# Altium project 电眼主板.PrjPCB
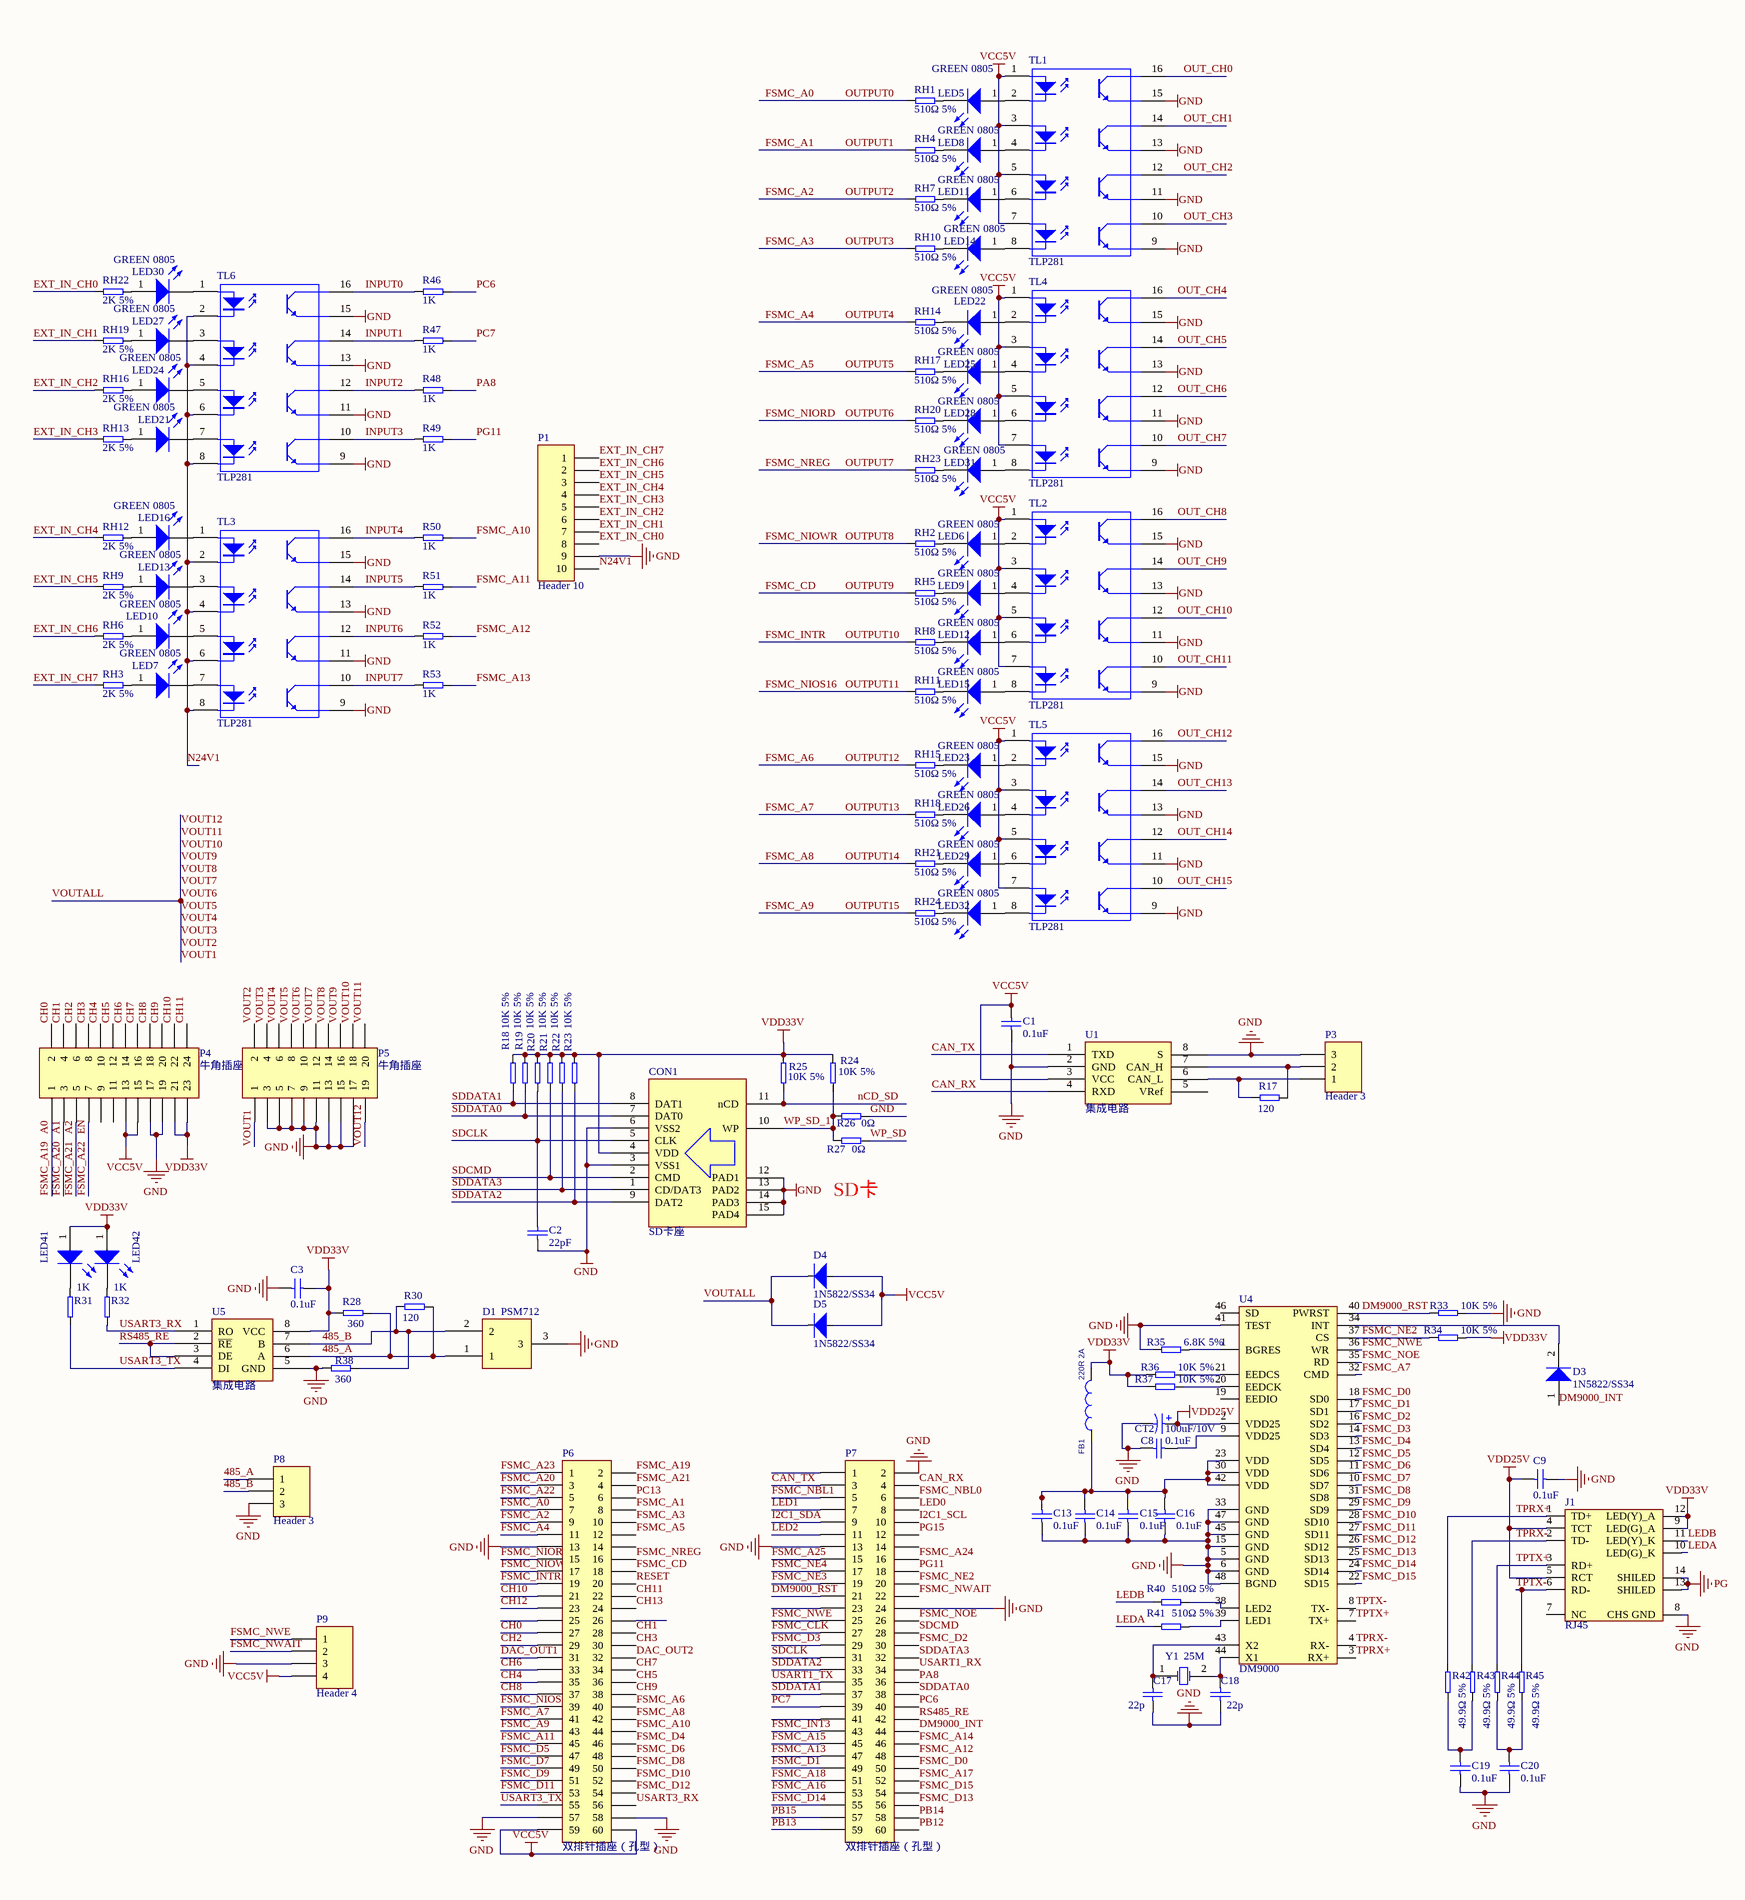
[diagram p0: 电眼主板.SchDoc, left]
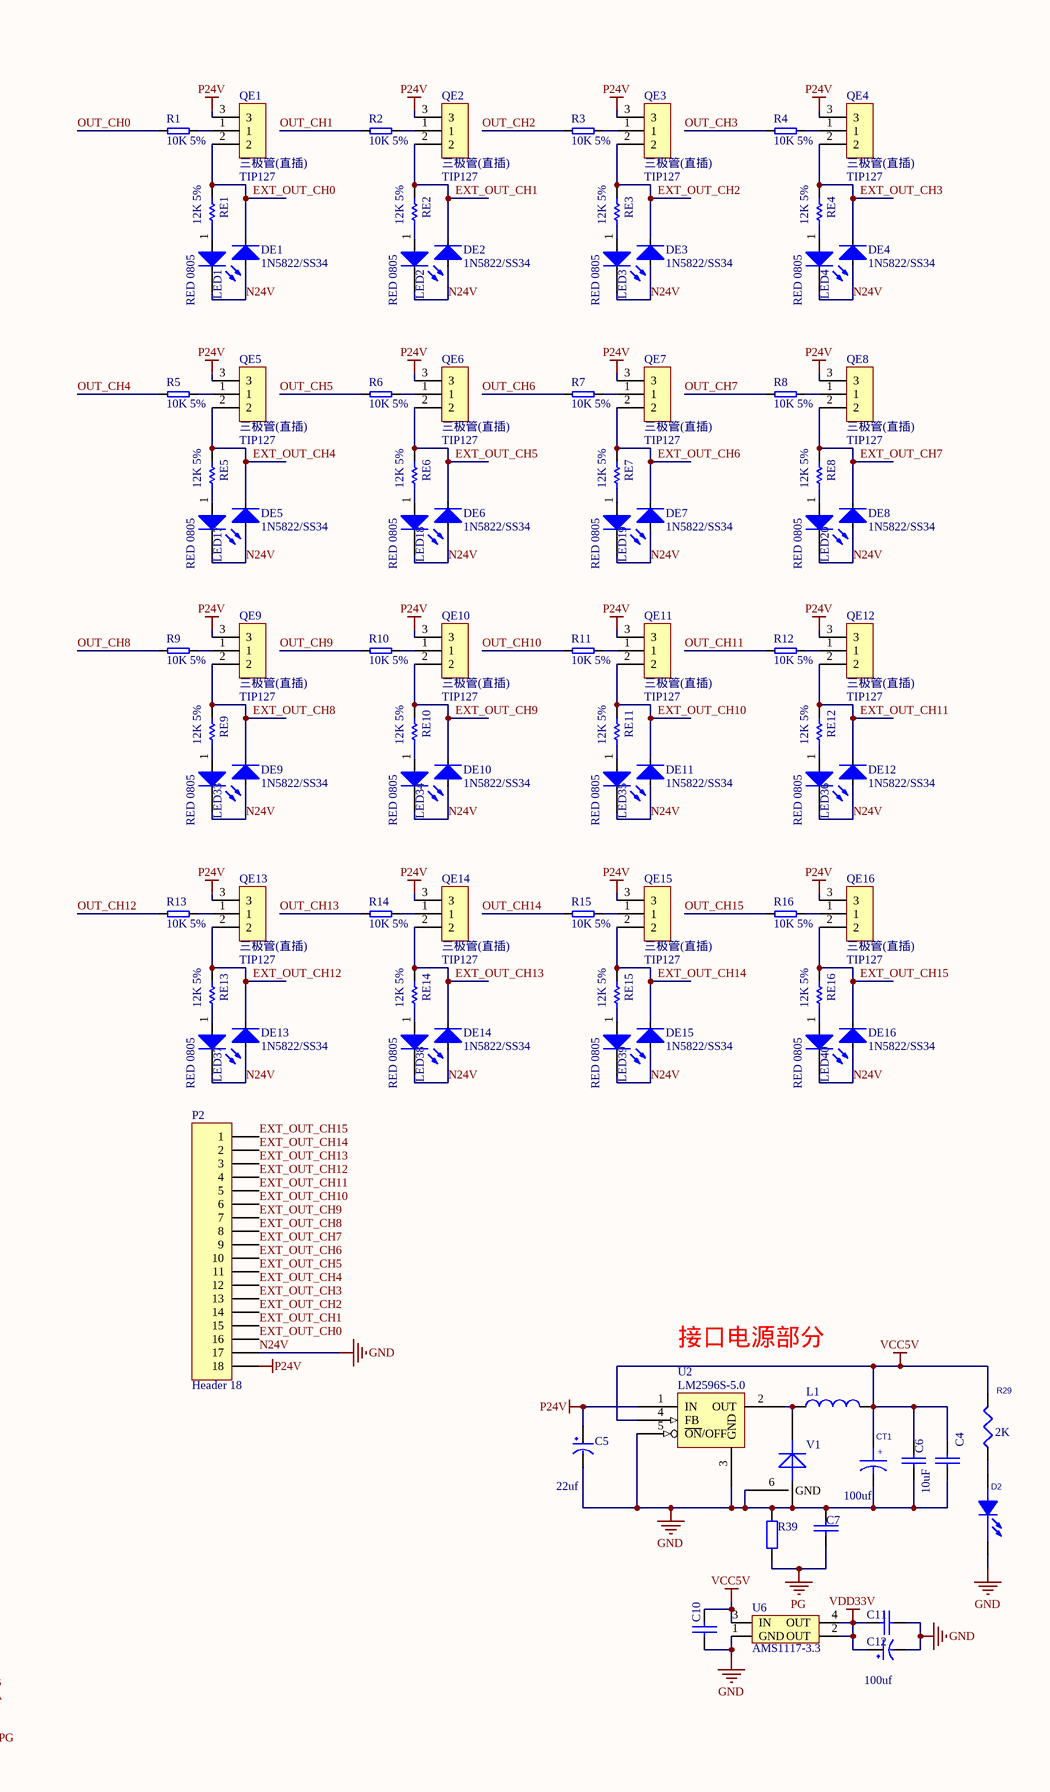
[diagram p1: 电眼主板.SchDoc, right]
1 sheet, 220 parts. Net scope: global (net labels, ports and power ports of the same name join across sheets).
Board file: 电眼主板.PcbDoc

## Sheet 电眼主板.SchDoc
size A2

### Parts
C1  value 0.1uF  [0603]  (hidden comment: 电容(贴片))
C2  value 22pF  [0603]  (hidden comment: 电容(贴片))
C3  value 0.1uF  [0603]  (hidden comment: 电容(贴片))
C4  电容(贴片)  [0805C]  (value not drawn)
C5  value 22uf  [CC6.56.5]  (hidden comment: 电解电容(贴片))
C6  10uF  [0805C]
C7  102/2KV  [0805CC]  (value not drawn)
C8  value 0.1uF  [0603]  (hidden comment: 电容(贴片))
C9  value 0.1uF  [0603]  (hidden comment: 电容(贴片))
C10  电容(贴片)  [0805C]  (value not drawn)
C11  电容(贴片)  [0805C]  (value not drawn)
C12  value 100uf  [CC6.56.5]  (hidden comment: 电解电容(贴片))
C13  value 0.1uF  [0603]  (hidden comment: 电容(贴片))
C14  value 0.1uF  [0603]  (hidden comment: 电容(贴片))
C15  value 0.1uF  [0603]  (hidden comment: 电容(贴片))
C16  value 0.1uF  [0603]  (hidden comment: 电容(贴片))
C17  value 22p  [0603]  (hidden comment: 电容(贴片))
C18  value 22p  [0603]  (hidden comment: 电容(贴片))
C19  value 0.1uF  [0603]  (hidden comment: 电容(贴片))
C20  value 0.1uF  [0603]  (hidden comment: 电容(贴片))
CON1  SD卡座  [SDCARD]
CT1  value 100uf  [CT7343]  (hidden comment: 钽电容)
CT2  value 100uF/10V  [6032]  (hidden comment: 钽电容)
D1  PSM712  [SOT-23]
D2  二极管(贴片发光红色)  [LED-0805]  (value not drawn)
D3  value 1N5822/SS34  [D1206]  (hidden comment: 二极管(贴片))
D4  value 1N5822/SS34  [D1206]  (hidden comment: 二极管(贴片))
D5  value 1N5822/SS34  [D1206]  (hidden comment: 二极管(贴片))
DE1  value 1N5822/SS34  [D1206]  (hidden comment: 二极管(贴片))
DE2  value 1N5822/SS34  [D1206]  (hidden comment: 二极管(贴片))
DE3  value 1N5822/SS34  [D1206]  (hidden comment: 二极管(贴片))
DE4  value 1N5822/SS34  [D1206]  (hidden comment: 二极管(贴片))
DE5  value 1N5822/SS34  [D1206]  (hidden comment: 二极管(贴片))
DE6  value 1N5822/SS34  [D1206]  (hidden comment: 二极管(贴片))
DE7  value 1N5822/SS34  [D1206]  (hidden comment: 二极管(贴片))
DE8  value 1N5822/SS34  [D1206]  (hidden comment: 二极管(贴片))
DE9  value 1N5822/SS34  [D1206]  (hidden comment: 二极管(贴片))
DE10  value 1N5822/SS34  [D1206]  (hidden comment: 二极管(贴片))
DE11  value 1N5822/SS34  [D1206]  (hidden comment: 二极管(贴片))
DE12  value 1N5822/SS34  [D1206]  (hidden comment: 二极管(贴片))
DE13  value 1N5822/SS34  [D1206]  (hidden comment: 二极管(贴片))
DE14  value 1N5822/SS34  [D1206]  (hidden comment: 二极管(贴片))
DE15  value 1N5822/SS34  [D1206]  (hidden comment: 二极管(贴片))
DE16  value 1N5822/SS34  [D1206]  (hidden comment: 二极管(贴片))
FB1  220R 2A  [0805]
J1  RJ45  [HR911105A]
L1  电感(贴片)  [6045]  (value not drawn)
LED1  value RED 0805  [LED-0805]  (hidden comment: 二极管(贴片发光红色))
LED2  value RED 0805  [LED-0805]  (hidden comment: 二极管(贴片发光红色))
LED3  value RED 0805  [LED-0805]  (hidden comment: 二极管(贴片发光红色))
LED4  value RED 0805  [LED-0805]  (hidden comment: 二极管(贴片发光红色))
LED5  value GREEN 0805  [LED-0805]  (hidden comment: 二极管(贴片发光黄色))
LED6  value GREEN 0805  [LED-0805]  (hidden comment: 二极管(贴片发光黄色))
LED7  value GREEN 0805  [LED-0805]  (hidden comment: 二极管(贴片发光绿色))
LED8  value GREEN 0805  [LED-0805]  (hidden comment: 二极管(贴片发光黄色))
LED9  value GREEN 0805  [LED-0805]  (hidden comment: 二极管(贴片发光黄色))
LED10  value GREEN 0805  [LED-0805]  (hidden comment: 二极管(贴片发光绿色))
LED11  value GREEN 0805  [LED-0805]  (hidden comment: 二极管(贴片发光黄色))
LED12  value GREEN 0805  [LED-0805]  (hidden comment: 二极管(贴片发光黄色))
LED13  value GREEN 0805  [LED-0805]  (hidden comment: 二极管(贴片发光绿色))
LED14  value GREEN 0805  [LED-0805]  (hidden comment: 二极管(贴片发光黄色))
LED15  value GREEN 0805  [LED-0805]  (hidden comment: 二极管(贴片发光黄色))
LED16  value GREEN 0805  [LED-0805]  (hidden comment: 二极管(贴片发光绿色))
LED17  value RED 0805  [LED-0805]  (hidden comment: 二极管(贴片发光红色))
LED18  value RED 0805  [LED-0805]  (hidden comment: 二极管(贴片发光红色))
LED19  value RED 0805  [LED-0805]  (hidden comment: 二极管(贴片发光红色))
LED20  value RED 0805  [LED-0805]  (hidden comment: 二极管(贴片发光红色))
LED21  value GREEN 0805  [LED-0805]  (hidden comment: 二极管(贴片发光绿色))
LED22  value GREEN 0805  [LED-0805]  (hidden comment: 二极管(贴片发光黄色))
LED23  value GREEN 0805  [LED-0805]  (hidden comment: 二极管(贴片发光黄色))
LED24  value GREEN 0805  [LED-0805]  (hidden comment: 二极管(贴片发光绿色))
LED25  value GREEN 0805  [LED-0805]  (hidden comment: 二极管(贴片发光黄色))
LED26  value GREEN 0805  [LED-0805]  (hidden comment: 二极管(贴片发光黄色))
LED27  value GREEN 0805  [LED-0805]  (hidden comment: 二极管(贴片发光绿色))
LED28  value GREEN 0805  [LED-0805]  (hidden comment: 二极管(贴片发光黄色))
LED29  value GREEN 0805  [LED-0805]  (hidden comment: 二极管(贴片发光黄色))
LED30  value GREEN 0805  [LED-0805]  (hidden comment: 二极管(贴片发光绿色))
LED31  value GREEN 0805  [LED-0805]  (hidden comment: 二极管(贴片发光黄色))
LED32  value GREEN 0805  [LED-0805]  (hidden comment: 二极管(贴片发光黄色))
LED33  value RED 0805  [LED-0805]  (hidden comment: 二极管(贴片发光红色))
LED34  value RED 0805  [LED-0805]  (hidden comment: 二极管(贴片发光红色))
LED35  value RED 0805  [LED-0805]  (hidden comment: 二极管(贴片发光红色))
LED36  value RED 0805  [LED-0805]  (hidden comment: 二极管(贴片发光红色))
LED37  value RED 0805  [LED-0805]  (hidden comment: 二极管(贴片发光红色))
LED38  value RED 0805  [LED-0805]  (hidden comment: 二极管(贴片发光红色))
LED39  value RED 0805  [LED-0805]  (hidden comment: 二极管(贴片发光红色))
LED40  value RED 0805  [LED-0805]  (hidden comment: 二极管(贴片发光红色))
LED41  二极管(贴片发光绿色)  [LED-0805]  (value not drawn)
LED42  二极管(贴片发光绿色)  [LED-0805]  (value not drawn)
P1  Header 10  [CON10]
P2  Header 18  [CON18]
P3  Header 3  [CON3]
P4  牛角插座  [niujiaocha24P]
P5  牛角插座  [niujiaocha20p]
P6  双排针插座（孔型）  [HDR2X30]
P7  双排针插座（孔型）  [HDR2X30]
P8  Header 3  [CON3]
P9  Header 4  [con4]
QE1  三极管(直插)  value TIP127  [TIP127]
QE2  三极管(直插)  value TIP127  [TIP127]
QE3  三极管(直插)  value TIP127  [TIP127]
QE4  三极管(直插)  value TIP127  [TIP127]
QE5  三极管(直插)  value TIP127  [TIP127]
QE6  三极管(直插)  value TIP127  [TIP127]
QE7  三极管(直插)  value TIP127  [TIP127]
QE8  三极管(直插)  value TIP127  [TIP127]
QE9  三极管(直插)  value TIP127  [TIP127]
QE10  三极管(直插)  value TIP127  [TIP127]
QE11  三极管(直插)  value TIP127  [TIP127]
QE12  三极管(直插)  value TIP127  [TIP127]
QE13  三极管(直插)  value TIP127  [TIP127]
QE14  三极管(直插)  value TIP127  [TIP127]
QE15  三极管(直插)  value TIP127  [TIP127]
QE16  三极管(直插)  value TIP127  [TIP127]
R1  value 10K 5%  [0603]  (hidden comment: 电阻(贴片))
R2  value 10K 5%  [0603]  (hidden comment: 电阻(贴片))
R3  value 10K 5%  [0603]  (hidden comment: 电阻(贴片))
R4  value 10K 5%  [0603]  (hidden comment: 电阻(贴片))
R5  value 10K 5%  [0603]  (hidden comment: 电阻(贴片))
R6  value 10K 5%  [0603]  (hidden comment: 电阻(贴片))
R7  value 10K 5%  [0603]  (hidden comment: 电阻(贴片))
R8  value 10K 5%  [0603]  (hidden comment: 电阻(贴片))
R9  value 10K 5%  [0603]  (hidden comment: 电阻(贴片))
R10  value 10K 5%  [0603]  (hidden comment: 电阻(贴片))
R11  value 10K 5%  [0603]  (hidden comment: 电阻(贴片))
R12  value 10K 5%  [0603]  (hidden comment: 电阻(贴片))
R13  value 10K 5%  [0603]  (hidden comment: 电阻(贴片))
R14  value 10K 5%  [0603]  (hidden comment: 电阻(贴片))
R15  value 10K 5%  [0603]  (hidden comment: 电阻(贴片))
R16  value 10K 5%  [0603]  (hidden comment: 电阻(贴片))
R17  value 120  [0603]  (hidden comment: 电阻(贴片))
R18  value 10K 5%  [0603]  (hidden comment: 电阻(贴片))
R19  value 10K 5%  [0603]  (hidden comment: 电阻(贴片))
R20  value 10K 5%  [0603]  (hidden comment: 电阻(贴片))
R21  value 10K 5%  [0603]  (hidden comment: 电阻(贴片))
R22  value 10K 5%  [0603]  (hidden comment: 电阻(贴片))
R23  value 10K 5%  [0603]  (hidden comment: 电阻(贴片))
R24  value 10K 5%  [0603]  (hidden comment: 电阻(贴片))
R25  value 10K 5%  [0603]  (hidden comment: 电阻(贴片))
R26  value 0Ω  [0603]  (hidden comment: 电阻(贴片))
R27  value 0Ω  [0603]  (hidden comment: 电阻(贴片))
R28  value 360  [0603]  (hidden comment: 电阻(贴片))
R29  value 2K  [0603]
R30  value 120  [0603]  (hidden comment: 电阻(贴片))
R31  value 1K  [0805]  (hidden comment: 电阻(贴片))
R32  value 1K  [0805]  (hidden comment: 电阻(贴片))
R33  value 10K 5%  [0603]  (hidden comment: 电阻(贴片))
R34  value 10K 5%  [0603]  (hidden comment: 电阻(贴片))
R35  value 6.8K 5%  [0603]  (hidden comment: 电阻(贴片))
R36  value 10K 5%  [0603]  (hidden comment: 电阻(贴片))
R37  value 10K 5%  [0603]  (hidden comment: 电阻(贴片))
R38  value 360  [0603]  (hidden comment: 电阻(贴片))
R39  电阻(贴片)  [0805R]  (value not drawn)
R40  value 510Ω 5%  [0603]  (hidden comment: 电阻(贴片))
R41  value 510Ω 5%  [0603]  (hidden comment: 电阻(贴片))
R42  value 49.9Ω 5%  [0603]  (hidden comment: 电阻(贴片))
R43  value 49.9Ω 5%  [0603]  (hidden comment: 电阻(贴片))
R44  value 49.9Ω 5%  [0603]  (hidden comment: 电阻(贴片))
R45  value 49.9Ω 5%  [0603]  (hidden comment: 电阻(贴片))
R46  value 1K  [0603]  (hidden comment: 电阻(贴片))
R47  value 1K  [0603]  (hidden comment: 电阻(贴片))
R48  value 1K  [0603]  (hidden comment: 电阻(贴片))
R49  value 1K  [0603]  (hidden comment: 电阻(贴片))
R50  value 1K  [0603]  (hidden comment: 电阻(贴片))
R51  value 1K  [0603]  (hidden comment: 电阻(贴片))
R52  value 1K  [0603]  (hidden comment: 电阻(贴片))
R53  value 1K  [0603]  (hidden comment: 电阻(贴片))
RE1  value 12K 5%  [0805]  (hidden comment: 电阻(贴片))
RE2  value 12K 5%  [0805]  (hidden comment: 电阻(贴片))
RE3  value 12K 5%  [0805]  (hidden comment: 电阻(贴片))
RE4  value 12K 5%  [0805]  (hidden comment: 电阻(贴片))
RE5  value 12K 5%  [0805]  (hidden comment: 电阻(贴片))
RE6  value 12K 5%  [0805]  (hidden comment: 电阻(贴片))
RE7  value 12K 5%  [0805]  (hidden comment: 电阻(贴片))
RE8  value 12K 5%  [0805]  (hidden comment: 电阻(贴片))
RE9  value 12K 5%  [0805]  (hidden comment: 电阻(贴片))
RE10  value 12K 5%  [0805]  (hidden comment: 电阻(贴片))
RE11  value 12K 5%  [0805]  (hidden comment: 电阻(贴片))
RE12  value 12K 5%  [0805]  (hidden comment: 电阻(贴片))
RE13  value 12K 5%  [0805]  (hidden comment: 电阻(贴片))
RE14  value 12K 5%  [0805]  (hidden comment: 电阻(贴片))
RE15  value 12K 5%  [0805]  (hidden comment: 电阻(贴片))
RE16  value 12K 5%  [0805]  (hidden comment: 电阻(贴片))
RH1  value 510Ω 5%  [0805]  (hidden comment: 电阻(贴片))
RH2  value 510Ω 5%  [0805]  (hidden comment: 电阻(贴片))
RH3  value 2K 5%  [0805]  (hidden comment: 电阻(贴片))
RH4  value 510Ω 5%  [0805]  (hidden comment: 电阻(贴片))
RH5  value 510Ω 5%  [0805]  (hidden comment: 电阻(贴片))
RH6  value 2K 5%  [0805]  (hidden comment: 电阻(贴片))
RH7  value 510Ω 5%  [0805]  (hidden comment: 电阻(贴片))
RH8  value 510Ω 5%  [0805]  (hidden comment: 电阻(贴片))
RH9  value 2K 5%  [0805]  (hidden comment: 电阻(贴片))
RH10  value 510Ω 5%  [0805]  (hidden comment: 电阻(贴片))
RH11  value 510Ω 5%  [0805]  (hidden comment: 电阻(贴片))
RH12  value 2K 5%  [0805]  (hidden comment: 电阻(贴片))
RH13  value 2K 5%  [0805]  (hidden comment: 电阻(贴片))
RH14  value 510Ω 5%  [0805]  (hidden comment: 电阻(贴片))
RH15  value 510Ω 5%  [0805]  (hidden comment: 电阻(贴片))
RH16  value 2K 5%  [0805]  (hidden comment: 电阻(贴片))
RH17  value 510Ω 5%  [0805]  (hidden comment: 电阻(贴片))
RH18  value 510Ω 5%  [0805]  (hidden comment: 电阻(贴片))
RH19  value 2K 5%  [0805]  (hidden comment: 电阻(贴片))
RH20  value 510Ω 5%  [0805]  (hidden comment: 电阻(贴片))
RH21  value 510Ω 5%  [0805]  (hidden comment: 电阻(贴片))
RH22  value 2K 5%  [0805]  (hidden comment: 电阻(贴片))
RH23  value 510Ω 5%  [0805]  (hidden comment: 电阻(贴片))
RH24  value 510Ω 5%  [0805]  (hidden comment: 电阻(贴片))
TL1  value TLP281  [SOP16]  (hidden comment: 光耦(贴片))
TL2  value TLP281  [SOP16]  (hidden comment: 光耦(贴片))
TL3  value TLP281  [SOP16]  (hidden comment: 光耦(贴片))
TL4  value TLP281  [SOP16]  (hidden comment: 光耦(贴片))
TL5  value TLP281  [SOP16]  (hidden comment: 光耦(贴片))
TL6  value TLP281  [SOP16]  (hidden comment: 光耦(贴片))
U1  集成电路  [sop8]
U2  LM2596S-5.0  [TO-263]
U4  DM9000  [mTQFP48]
U5  集成电路  [sop8]
U6  AMS1117-3.3  [AMS1117]
V1  SK210B  [1812DT]  (value not drawn)
Y1  value 25M  [CRYSTAL_SMD]  (hidden comment: 晶体(贴片))

### Nets
GND: C1.2 C2.1 C3.1 C4.1 C5.2(GND) C6.2 C7.2 C8.2 C9.1 C10.1 C11.1 C12.2(GND) C13.1 C14.1 C15.1 C16.1 C17.2 C18.2 C19.1 C20.1 CON1.3(VSS1) CON1.6(VSS2) CON1.12(PAD1) CON1.13(PAD2) CON1.14(PAD3) CON1.15(PAD4) CT1.2(Negative) CT2.2 D1.3 D2.2(T-) DE1.1(A) DE2.1(A) DE3.1(A) DE4.1(A) DE5.1(A) DE6.1(A) DE7.1(A) DE8.1(A) DE9.1(A) DE10.1(A) DE11.1(A) DE12.1(A) DE13.1(A) DE14.1(A) DE15.1(A) DE16.1(A) J1.8(CHS_GND) LED1.2(K) LED2.2(K) LED3.2(K) LED4.2(K) LED17.2(K) LED18.2(K) LED19.2(K) LED20.2(K) LED33.2(K) LED34.2(K) LED35.2(K) LED36.2(K) LED37.2(K) LED38.2(K) LED39.2(K) LED40.2(K) P1.9 P2.17 P3.3 P4.17 P4.19 P5.3 P5.5 P5.7 P5.9 P5.11 P5.13 P5.15 P5.17 P6.13 P6.57 P6.58 P7.2 P7.13 P7.24 P8.3 P9.3 R26.2 R33.2 R35.1 R38.2 R39.1 TL1.9(E) TL1.11(E) TL1.13(E) TL1.15(E) TL2.9(E) TL2.11(E) TL2.13(E) TL2.15(E) TL3.9(E) TL3.11(E) TL3.13(E) TL3.15(E) TL4.9(E) TL4.11(E) TL4.13(E) TL4.15(E) TL5.9(E) TL5.11(E) TL5.13(E) TL5.15(E) TL6.9(E) TL6.11(E) TL6.13(E) TL6.15(E) U1.2(GND) U1.8(S) U2.3(GND) U2.5(~{ON}/OFF) U2.6(GND) U4.5(GND) U4.6(GND) U4.15(GND) U4.33(GND) U4.41(TEST) U4.45(GND) U4.47(GND) U4.48(BGND) U5.5(GND) U6.1(GND) V1.1(A)  [also labelled N24V]
P24V: C5.1(VCC) P2.18 QE1.3 QE2.3 QE3.3 QE4.3 QE5.3 QE6.3 QE7.3 QE8.3 QE9.3 QE10.3 QE11.3 QE12.3 QE13.3 QE14.3 QE15.3 QE16.3 U2.1(IN)
PG: C7.1 J1.13(SHILED) J1.14(SHILED) R39.2
VCC5V: C1.1 C4.2 C6.1 C10.2 CT1.1(Positive) D4.1(A) D5.1(A) L1.2 P4.13 P4.15 P6.59 P6.60 P9.4 R29.2 TL1.1(A) TL1.3(A) TL1.5(A) TL1.7(A) TL2.1(A) TL2.3(A) TL2.5(A) TL2.7(A) TL4.1(A) TL4.3(A) TL4.5(A) TL4.7(A) TL5.1(A) TL5.3(A) TL5.5(A) TL5.7(A) U1.3(VCC) U2.4(FB) U6.3(IN)
VDD25V: C9.2 CT2.1 J1.4(TCT) J1.5(RCT) U4.2(VDD25)
VDD33V: C3.2 C11.2 C12.1(VCC) CON1.4(VDD) FB1.2 J1.9(LED(G)_A) J1.12(LED(Y)_A) LED41.1(A) LED42.1(A) P4.21 P4.23 R18.1 R19.1 R20.1 R21.1 R22.1 R23.1 R24.1 R25.1 R28.2 R34.2 R36.1 R37.1 U5.8(VCC) U6.2(OUT) U6.4(OUT)
485_A: D1.1 P8.1 R28.1 R30.1 U5.6(A)
485_B: D1.2 P8.2 R30.2 R38.1 U5.7(B)
A0: P4.1 P6.2  [also labelled FSMC_A19]
A1: P4.3 P6.3  [also labelled FSMC_A20]
A2: P4.5 P6.4  [also labelled FSMC_A21]
CAN_RX: P7.4 U1.4(RXD)
CAN_TX: P7.3 U1.1(TXD)
CH0: P4.2 P6.27
CH1: P4.4 P6.28
CH2: P4.6 P6.29
CH3: P4.8 P6.30
CH4: P4.10 P6.35
CH5: P4.12 P6.36
CH6: P4.14 P6.33
CH7: P4.16 P6.34
CH8: P4.18 P6.37
CH9: P4.20 P6.38
CH10: P4.22 P6.21
CH11: P4.24 P6.22
CH12: P6.23
CH13: P6.24
DAC_OUT1: P6.31
DAC_OUT2: P6.32
DM9000_INT: D3.1(A) P7.44
DM9000_RST: P7.21 R33.1 U4.40(PWRST)
EN: P4.7 P6.5  [also labelled FSMC_A22]
EXT_IN_CH0: P1.8 RH22.2
EXT_IN_CH1: P1.7 RH19.2
EXT_IN_CH2: P1.6 RH16.2
EXT_IN_CH3: P1.5 RH13.2
EXT_IN_CH4: P1.4 RH12.2
EXT_IN_CH5: P1.3 RH9.2
EXT_IN_CH6: P1.2 RH6.2
EXT_IN_CH7: P1.1 RH3.2
EXT_OUT_CH0: DE1.2(K) P2.16 QE1.2 RE1.1
EXT_OUT_CH1: DE2.2(K) P2.15 QE2.2 RE2.1
EXT_OUT_CH2: DE3.2(K) P2.14 QE3.2 RE3.1
EXT_OUT_CH3: DE4.2(K) P2.13 QE4.2 RE4.1
EXT_OUT_CH4: DE5.2(K) P2.12 QE5.2 RE5.1
EXT_OUT_CH5: DE6.2(K) P2.11 QE6.2 RE6.1
EXT_OUT_CH6: DE7.2(K) P2.10 QE7.2 RE7.1
EXT_OUT_CH7: DE8.2(K) P2.9 QE8.2 RE8.1
EXT_OUT_CH8: DE9.2(K) P2.8 QE9.2 RE9.1
EXT_OUT_CH9: DE10.2(K) P2.7 QE10.2 RE10.1
EXT_OUT_CH10: DE11.2(K) P2.6 QE11.2 RE11.1
EXT_OUT_CH11: DE12.2(K) P2.5 QE12.2 RE12.1
EXT_OUT_CH12: DE13.2(K) P2.4 QE13.2 RE13.1
EXT_OUT_CH13: DE14.2(K) P2.3 QE14.2 RE14.1
EXT_OUT_CH14: DE15.2(K) P2.2 QE15.2 RE15.1
EXT_OUT_CH15: DE16.2(K) P2.1 QE16.2 RE16.1
FSMC_A0: P6.7 RH1.2  [also labelled OUTPUT0]
FSMC_A1: P6.8 RH4.2  [also labelled OUTPUT1]
FSMC_A2: P6.9 RH7.2  [also labelled OUTPUT2]
FSMC_A3: P6.10 RH10.2  [also labelled OUTPUT3]
FSMC_A4: P6.11 RH14.2  [also labelled OUTPUT4]
FSMC_A5: P6.12 RH17.2  [also labelled OUTPUT5]
FSMC_A6: P6.40 RH15.2  [also labelled OUTPUT12]
FSMC_A7: P6.41 RH18.2 U4.32(CMD)  [also labelled OUTPUT13]
FSMC_A8: P6.42 RH21.2  [also labelled OUTPUT14]
FSMC_A9: P6.43 RH24.2  [also labelled OUTPUT15]
FSMC_A10: P6.44 R50.1
FSMC_A11: P6.45 R51.1
FSMC_A12: P7.48 R52.1
FSMC_A13: P7.47 R53.1
FSMC_A14: P7.46
FSMC_A15: P7.45
FSMC_A16: P7.53
FSMC_A17: P7.52
FSMC_A18: P7.51
FSMC_A23: P6.1
FSMC_A24: P7.16
FSMC_A25: P7.15
FSMC_CD: P6.18 RH5.2  [also labelled OUTPUT9]
FSMC_CLK: P7.27
FSMC_D0: P7.50 U4.18(SD0)
FSMC_D1: P7.49 U4.17(SD1)
FSMC_D2: P7.30 U4.16(SD2)
FSMC_D3: P7.29 U4.14(SD3)
FSMC_D4: P6.46 U4.13(SD4)
FSMC_D5: P6.47 U4.12(SD5)
FSMC_D6: P6.48 U4.11(SD6)
FSMC_D7: P6.49 U4.10(SD7)
FSMC_D8: P6.50 U4.31(SD8)
FSMC_D9: P6.51 U4.29(SD9)
FSMC_D10: P6.52 U4.28(SD10)
FSMC_D11: P6.53 U4.27(SD11)
FSMC_D12: P6.54 U4.26(SD12)
FSMC_D13: P7.56 U4.25(SD13)
FSMC_D14: P7.55 U4.24(SD14)
FSMC_D15: P7.54 U4.22(SD15)
FSMC_INT3: P7.43
FSMC_INTR: P6.19 RH8.2  [also labelled OUTPUT10]
FSMC_NBL0: P7.6
FSMC_NBL1: P7.5
FSMC_NE2: P7.20 R34.1 U4.37(CS)
FSMC_NE3: P7.19
FSMC_NE4: P7.17
FSMC_NIORD: P6.15 RH20.2  [also labelled OUTPUT6]
FSMC_NIOS16: P6.39 RH11.2  [also labelled OUTPUT11]
FSMC_NIOWR: P6.17 RH2.2  [also labelled OUTPUT8]
FSMC_NOE: P7.26 U4.35(RD)
FSMC_NREG: P6.16 RH23.2  [also labelled OUTPUT7]
FSMC_NWAIT: P7.22 P9.2
FSMC_NWE: P7.25 P9.1 U4.36(WR)
I2C1_SCL: P7.10
I2C1_SDA: P7.9
INPUT0: R46.2 TL6.16(C)
INPUT1: R47.2 TL6.14(C)
INPUT2: R48.2 TL6.12(C)
INPUT3: R49.2 TL6.10(C)
INPUT4: R50.2 TL3.16(C)
INPUT5: R51.2 TL3.14(C)
INPUT6: R52.2 TL3.12(C)
INPUT7: R53.2 TL3.10(C)
LED0: P7.8
LED1: P7.7
LED2: P7.11
LEDA: J1.10(LED(G)_K) R41.2
LEDB: J1.11(LED(Y)_K) R40.2
N24V1: P1.10 TL3.2(K) TL3.4(K) TL3.6(K) TL3.8(K) TL6.2(K) TL6.4(K) TL6.6(K) TL6.8(K)
nCD_SD: CON1.11(nCD) R25.2
OUT_CH0: R1.1 TL1.16(C)
OUT_CH1: R2.1 TL1.14(C)
OUT_CH2: R3.1 TL1.12(C)
OUT_CH3: R4.1 TL1.10(C)
OUT_CH4: R5.1 TL4.16(C)
OUT_CH5: R6.1 TL4.14(C)
OUT_CH6: R7.1 TL4.12(C)
OUT_CH7: R8.1 TL4.10(C)
OUT_CH8: R9.1 TL2.16(C)
OUT_CH9: R10.1 TL2.14(C)
OUT_CH10: R11.1 TL2.12(C)
OUT_CH11: R12.1 TL2.10(C)
OUT_CH12: R13.1 TL5.16(C)
OUT_CH13: R14.1 TL5.14(C)
OUT_CH14: R15.1 TL5.12(C)
OUT_CH15: R16.1 TL5.10(C)
PA8: P7.36 R48.1
PB12: P7.60
PB13: P7.59
PB14: P7.58
PB15: P7.57
PC6: P7.40 R46.1
PC7: P7.39 R47.1
PC13: P6.6
PG11: P7.18 R49.1
PG15: P7.12
RESET: P6.20
RS485_RE: P7.42 U5.2(~{RE}) U5.3(DE)
SDCLK: C2.2 CON1.5(CLK) P7.31 R20.2
SDCMD: CON1.2(CMD) P7.28 R21.2
SDDATA0: CON1.7(DAT0) P7.38 R19.2
SDDATA1: CON1.8(DAT1) P7.37 R18.2
SDDATA2: CON1.9(DAT2) P7.33 R23.2
SDDATA3: CON1.1(CD/DAT3) P7.32 R22.2
TPRX+: J1.1(TD+) R42.2 U4.3(RX+)
TPRX-: J1.2(TD-) R43.2 U4.4(RX-)
TPTX+: J1.3(RD+) R44.2 U4.7(TX+)
TPTX-: J1.6(RD-) R45.2 U4.8(TX-)
USART1_RX: P7.34
USART1_TX: P7.35
USART3_RX: P6.56 R32.1 U5.1(RO)
USART3_TX: P6.55 R31.1 U5.4(DI)
VOUT1: D4.2(K) D5.2(K) P5.1 P5.2 P5.4 P5.6 P5.8 P5.10 P5.12 P5.14 P5.16 P5.18 P5.19 P5.20  [also labelled VOUT10, VOUT11, VOUT12, VOUT2, VOUT3, VOUT4, VOUT5, VOUT6, VOUT7, VOUT8, VOUT9, VOUTALL]
WP_SD: R27.2
WP_SD_1: CON1.10(WP) R24.2 R26.1 R27.1
NetC8_1: C8.1 U4.9(VDD25)
NetC13_2: C13.2 C14.2 C15.2 C16.2 FB1.1 U4.23(VDD) U4.30(VDD) U4.42(VDD)
NetC17_1: C17.1 U4.43(X2) Y1.1(OSC1)
NetC18_1: C18.1 U4.44(X1) Y1.2(OSC2)
NetC19_2: C19.2 R42.1 R43.1
NetC20_2: C20.2 R44.1 R45.1
NetD2_1: D2.1(B-) R29.1
NetD3_2: D3.2(K) U4.34(INT)
NetL1_1: L1.1 U2.2(OUT) V1.2(K)
NetLED1_1: LED1.1(A) RE1.2
NetLED2_1: LED2.1(A) RE2.2
NetLED3_1: LED3.1(A) RE3.2
NetLED4_1: LED4.1(A) RE4.2
NetLED5_1: LED5.1(A) TL1.2(K)
NetLED5_2: LED5.2(K) RH1.1
NetLED6_1: LED6.1(A) TL2.2(K)
NetLED6_2: LED6.2(K) RH2.1
NetLED7_1: LED7.1(A) RH3.1
NetLED7_2: LED7.2(K) TL3.7(A)
NetLED8_1: LED8.1(A) TL1.4(K)
NetLED8_2: LED8.2(K) RH4.1
NetLED9_1: LED9.1(A) TL2.4(K)
NetLED9_2: LED9.2(K) RH5.1
NetLED10_1: LED10.1(A) RH6.1
NetLED10_2: LED10.2(K) TL3.5(A)
NetLED11_1: LED11.1(A) TL1.6(K)
NetLED11_2: LED11.2(K) RH7.1
NetLED12_1: LED12.1(A) TL2.6(K)
NetLED12_2: LED12.2(K) RH8.1
NetLED13_1: LED13.1(A) RH9.1
NetLED13_2: LED13.2(K) TL3.3(A)
NetLED14_1: LED14.1(A) TL1.8(K)
NetLED14_2: LED14.2(K) RH10.1
NetLED15_1: LED15.1(A) TL2.8(K)
NetLED15_2: LED15.2(K) RH11.1
NetLED16_1: LED16.1(A) RH12.1
NetLED16_2: LED16.2(K) TL3.1(A)
NetLED17_1: LED17.1(A) RE5.2
NetLED18_1: LED18.1(A) RE6.2
NetLED19_1: LED19.1(A) RE7.2
NetLED20_1: LED20.1(A) RE8.2
NetLED21_1: LED21.1(A) RH13.1
NetLED21_2: LED21.2(K) TL6.7(A)
NetLED22_1: LED22.1(A) TL4.2(K)
NetLED22_2: LED22.2(K) RH14.1
NetLED23_1: LED23.1(A) TL5.2(K)
NetLED23_2: LED23.2(K) RH15.1
NetLED24_1: LED24.1(A) RH16.1
NetLED24_2: LED24.2(K) TL6.5(A)
NetLED25_1: LED25.1(A) TL4.4(K)
NetLED25_2: LED25.2(K) RH17.1
NetLED26_1: LED26.1(A) TL5.4(K)
NetLED26_2: LED26.2(K) RH18.1
NetLED27_1: LED27.1(A) RH19.1
NetLED27_2: LED27.2(K) TL6.3(A)
NetLED28_1: LED28.1(A) TL4.6(K)
NetLED28_2: LED28.2(K) RH20.1
NetLED29_1: LED29.1(A) TL5.6(K)
NetLED29_2: LED29.2(K) RH21.1
NetLED30_1: LED30.1(A) RH22.1
NetLED30_2: LED30.2(K) TL6.1(A)
NetLED31_1: LED31.1(A) TL4.8(K)
NetLED31_2: LED31.2(K) RH23.1
NetLED32_1: LED32.1(A) TL5.8(K)
NetLED32_2: LED32.2(K) RH24.1
NetLED33_1: LED33.1(A) RE9.2
NetLED34_1: LED34.1(A) RE10.2
NetLED35_1: LED35.1(A) RE11.2
NetLED36_1: LED36.1(A) RE12.2
NetLED37_1: LED37.1(A) RE13.2
NetLED38_1: LED38.1(A) RE14.2
NetLED39_1: LED39.1(A) RE15.2
NetLED40_1: LED40.1(A) RE16.2
NetLED41_2: LED41.2(K) R31.2
NetLED42_2: LED42.2(K) R32.2
NetP3_1: P3.1 R17.2 U1.6(CAN_L)
NetP3_2: P3.2 R17.1 U1.7(CAN_H)
NetQE1_1: QE1.1 R1.2
NetQE2_1: QE2.1 R2.2
NetQE3_1: QE3.1 R3.2
NetQE4_1: QE4.1 R4.2
NetQE5_1: QE5.1 R5.2
NetQE6_1: QE6.1 R6.2
NetQE7_1: QE7.1 R7.2
NetQE8_1: QE8.1 R8.2
NetQE9_1: QE9.1 R9.2
NetQE10_1: QE10.1 R10.2
NetQE11_1: QE11.1 R11.2
NetQE12_1: QE12.1 R12.2
NetQE13_1: QE13.1 R13.2
NetQE14_1: QE14.1 R14.2
NetQE15_1: QE15.1 R15.2
NetQE16_1: QE16.1 R16.2
NetR35_2: R35.2 U4.1(BGRES)
NetR36_2: R36.2 U4.21(EEDCS)
NetR37_2: R37.2 U4.20(EEDCK)
NetR40_1: R40.1 U4.38(LED2)
NetR41_1: R41.1 U4.39(LED1)

Not connected (* = marked no-connect by the designer): J1 7(NC); P4 9 11; P6 14 25 26; P7 1 14 23 41; U1 5(VRef); U4 19(EEDIO) 46(SD)

### Notes on the sheet
- (near R27) SD卡
- 接口电源部分
- (in symbol CAP POL) +

### Library data of the parts
C1 C3 C8 C9 C13-C16 C19 C20 = CAP_0.1uF X7R 0603: 0603X7R104J160NT(0.1uF); ERP: 1508001607
C2 = CAP_22pF COG 0603: 0603COG220J500NT(22pF); ERP: 1508001603
C4 C10 C11 = CAP: '0603X7R104J160NT(0.1uF)
C5 = CAP: 35TZV22M5X6.1
C6 = Pro92D1.TMP_105_9: 片状电容
C7 = CAP
C12 = CAP: 10SEV100M6.3X5.5
C17 C18 = Cap: Capacitor 22p; Published: 8-Jun-2000; LatestRevisionDate: 17-Jul-2002; LatestRevisionNote: Re-released for DXP Platform.; PackageReference: RAD-0.3; Publisher: Altium Limited
CON1 = SD-CARD: SD/MMC CARD 26mm*25mm; ERP: 1508075003
CT1 = CAP POL: CAP TANTALUM 100UF 16V 20% SMD; Vendor Part#: 495-2256-1-ND; Mfg Part#: B45196H3107M409; Vendor: DigiKey; Mfg: Kemet; Oper. Temp. Range: -55C to 125C; RoHS: Yes; Specifications: CAP TANTALUM 100UF 16V 20% SMD; Package: 7343-31
CT2 = CAP TAN 100uF/10V/6032: CAP TANTALUM 100UF 16V 20% SMD; ERP: 1508009008
D1 = Component_1
D2 = LED: 17-215-SURC-S530-A3-TR8; Vendor Part#: 160-1426-1-ND; Mfg Part#: LTST-C171KGKT; Vendor: DigiKey; Oper. Temp. Range: -25 to +85C; Specifications: LED GREEN CLEAR THIN 0805 SMD; Mfg: Lite-On Inc; Package: 0805; RoHS: Yes; Mfgr.: Lite-On Inc
D3 = DIODE 1N4148/1206: 1N4148/1206; ERP: 1508036001
D4 D5 DE1-DE16 = DIODE 1N5822/SS34: 1N5822/SS34/SMA 肖特基; ERP: 1508036005
FB1 = FERRITE: 220R,2.0A,0.05DCR; Mfg Part#: BLM18PG121SN1D; Vendor Part#: 490-1037-1-ND; Mfg: Murata; Vendor: DigiKey; Specifications: FERRITE CHIP 120 OHM 2000MA 0603; Oper. Temp. Range: -55C to 125C; Package: 0603; RoHS: Yes
J1 = HR911105: HR911105A
L1 = Inductor: PRS6045-330MT; Code_IEC: 1005; Value: 33uH 1.5A; Published: 8-Jun-2000; LatestRevisionDate: 17-Jul-2002; LatestRevisionNote: Re-released for DXP Platform.; PackageReference: 0402-A; Publisher: Altium Limited; Code_JEITA: 0402
LED1-LED4 LED17-LED20 LED33-LED40 = LED_GREEN 0805: '17-215-SURC-S530-A3-TR8; ERP: 1508038003
LED5 LED6 LED8 LED9 LED11 LED12 LED14 LED15 LED22 LED23 LED25 LED26 LED28 LED29 LED31 LED32 = LED_GREEN 0805: 黄色LED; ERP: 1508038003
LED7 LED10 LED13 LED16 LED21 LED24 LED27 LED30 LED41 LED42 = LED_GREEN 0805: 17-215SYGC-S530-E2-TR8; ERP: 1508038003
  LED41 LED42: value: GREEN 0805
P1 = Header 10: Header, 10-Pin; LatestRevisionDate: 17-Jul-2002; LatestRevisionNote: Re-released for DXP Platform.; Publisher: Altium Limited
P2 = Header 18: Header, 18-Pin; LatestRevisionDate: 17-Jul-2002; LatestRevisionNote: Re-released for DXP Platform.; Publisher: Altium Limited
P3 P8 = Header 3: Header, 3-Pin; LatestRevisionDate: 17-Jul-2002; LatestRevisionNote: Re-released for DXP Platform.; Publisher: Altium Limited
P4 = Header 12X2: Header, 12-Pin, Dual row; LatestRevisionDate: 17-Jul-2002; LatestRevisionNote: Re-released for DXP Platform.; Publisher: Altium Limited
P5 = Header 10X2: Header, 10-Pin, Dual row; LatestRevisionDate: 17-Jul-2002; LatestRevisionNote: Re-released for DXP Platform.; Publisher: Altium Limited
P6 P7 = Header 30X2: 双排 30*2P 脚间距 2.54mm; LatestRevisionDate: 17-Jul-2002; LatestRevisionNote: Re-released for DXP Platform.; Publisher: Altium Limited
P9 = Header 4: Header, 4-Pin; LatestRevisionDate: 17-Jul-2002; LatestRevisionNote: Re-released for DXP Platform.; Publisher: Altium Limited
QE1-QE16 = TIP127
R1-R16 R18-R25 R33-R37 = RES_10K 5% 0603: RS-03K-103±5%(10KΩ); ERP: 1508022701
R17 R28 R30-R32 R38 R46-R53 = RES_1K  5% 0603: RS-03K-102±5%(1KΩ); ERP: 1508022715
R26 R27 = RES_0Ω 5% 0603: RS-03K-000±5%(0Ω); ERP: 1508022706
R29 = RESISTOR_Dup1: 电阻(贴片); Vendor Part#: P2.2KJCT-ND; Mfg Part#: ERJ-2GEJ222X; Specifications: RES 2.2K OHM 1/10W 5% 0402 SMD; Vendor: DigiKey; Mfg: Panasonic - ECG; RoHS: Yes; Package: 0402
R39 = Res2: Resistor; Value: 1M; Published: 8-Jun-2000; LatestRevisionDate: 17-Jul-2002; LatestRevisionNote: Re-released for DXP Platform.; PackageReference: AXIAL-0.4; Publisher: Altium Limited
R40-R45 = RES_10K 5% 0603: RS-03K-49.9±5%(49.9Ω); ERP: 1508022701
RE1-RE12 RE14-RE16 = RES_5.1K 5% 0805: RS-05K-512±5%(5.1KΩ 5%); ERP: 1508022014
RE13 = RES_5.1K 5% 0805: RS-05K-123±5%(12KΩ 5%); ERP: 1508022014
RH1 RH2 RH4 RH5 RH7 RH8 RH10 RH11 RH14 RH15 RH17 RH18 RH20 RH21 RH23 RH24 = RES_200Ω5% 0805: RS-05K-511±5%(510Ω); ERP: 1508022003
RH3 RH6 RH9 RH12 RH13 RH16 RH19 RH22 = RES_200Ω5% 0805: RS-05K-2K±5%(2K); ERP: 1508022003
TL1-TL6 = 隔离光耦 TLP281-4/SOP16: TLP281-4/SOP16; ERP: 1508049901
U1 = TJA1050
U2 = LM2575T5.0(5): SIMPLE SWITCHER 1A STEP DOWN VOLTAGE REGULATOR
U4 = DM9000A
U5 = SP485
U6 = AMS1117
V1 = DIODE1: 1N5824; Footprint: RC22
Y1 = CRYSTAL 12M HC-49SMD: HC-49SMD/25.000MHz; ERP: 1508043206; Published: 8-Jun-2000; Publisher: Altium Limited; Revision: July-2002: Re-released for DXP Platform.